# EAGLE design solderpeek (EAGLE 7.2.0)
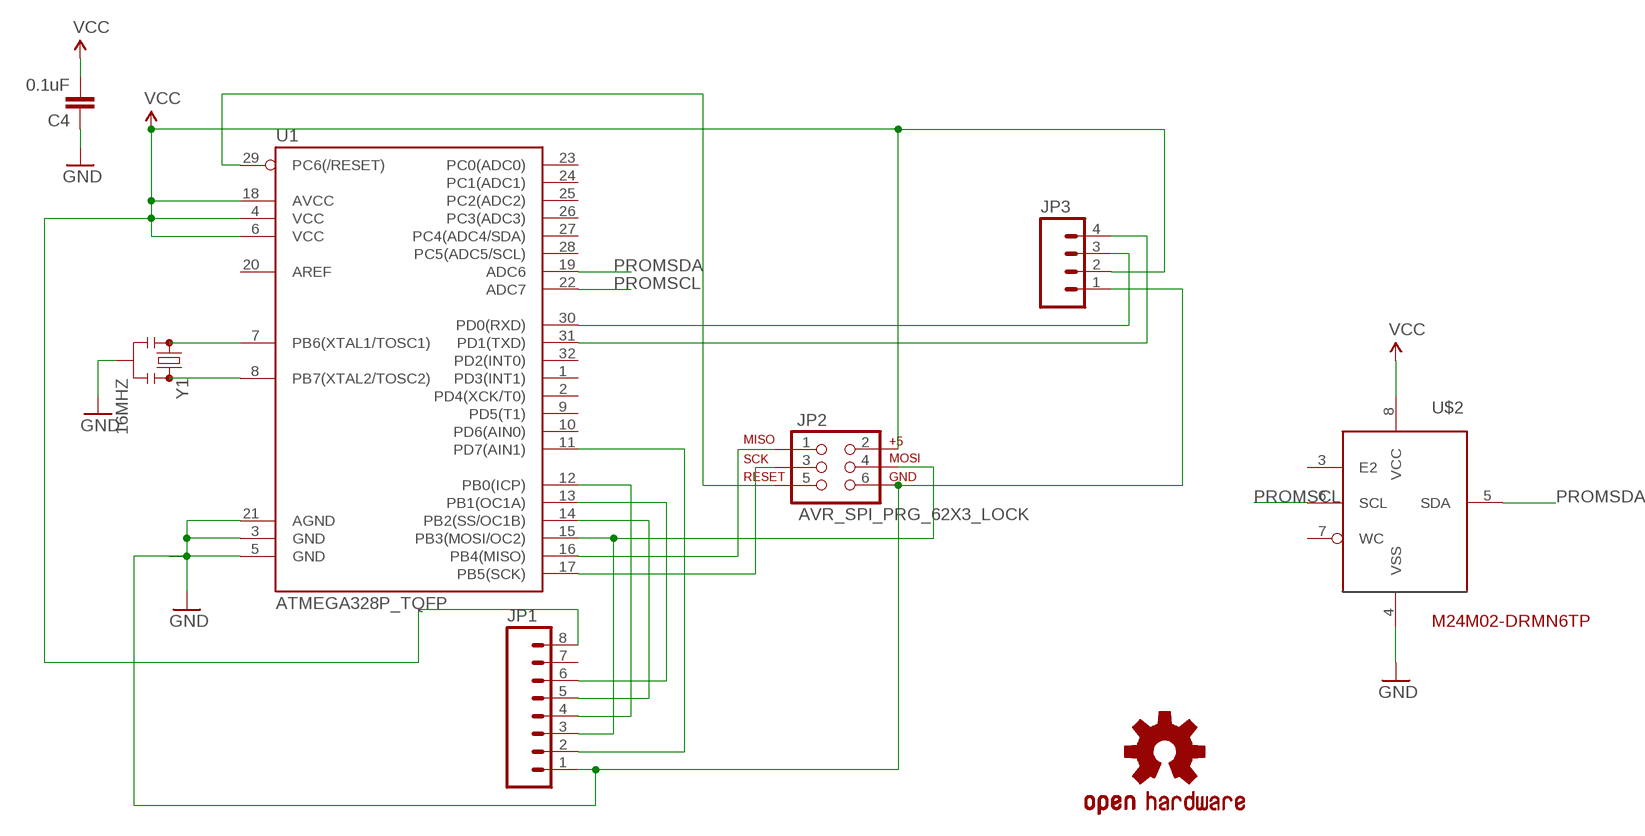
[diagram p0: schematic, sheet 1]

## Parts
C4  0.1uF  0.1UF-25V(+80/-20%)(0603)  [0603-CAP]
JP1  M08LOCK  [1X08_LOCK]
JP2  AVR_SPI_PRG_62X3_LOCK  [2X3_LOCK]
JP3  M04LOCK  [1X04_LOCK]
LOGO1  OSHW-LOGOS  [OSHW-LOGO-S]
U1  ATMEGA328P_TQFP  [TQFP32-08]
U$2  M24M02-DRMN6TP  [SO8]
Y1  16MHZ  RESONATOR16MHZ  [RESONATOR-SMD]

## Nets
GND [power]: C4.1 JP1.1 JP2.6 JP3.1 U1.3(GND) U1.5(GND) U1.21(AGND) U$2.4(VSS) Y1.2
N$1: U1.7(PB6(XTAL1/TOSC1)) Y1.1
N$2: U1.8(PB7(XTAL2/TOSC2)) Y1.3
N$3: JP2.1 U1.16(PB4(MISO))
N$4: JP1.3 JP2.4 U1.15(PB3(MOSI/OC2))
N$5: JP1.4 U1.12(PB0(ICP))
N$6: JP1.5 U1.14(PB2(SS/OC1B))
N$7: JP1.6 U1.13(PB1(OC1A))
N$8: JP1.2 U1.11(PD7(AIN1))
N$9: JP2.3 U1.17(PB5(SCK))
N$10: JP2.5 U1.29(PC6(/RESET))
N$11: JP3.3 U1.30(PD0(RXD))
N$12: JP3.4 U1.31(PD1(TXD))
PROMSCL: U1.22(ADC7) U$2.6(SCL)
PROMSDA: U1.19(ADC6) U$2.5(SDA)
VCC [power]: C4.2 JP1.8 JP2.2 JP3.2 U1.4(VCC) U1.6(VCC) U1.18(AVCC) U$2.8(VCC)
Unconnected: JP1.7 U1.1(PD3(INT1)) U1.2(PD4(XCK/T0)) U1.9(PD5(T1)) U1.10(PD6(AIN0)) U1.20(AREF) U1.23(PC0(ADC0)) U1.24(PC1(ADC1)) U1.25(PC2(ADC2)) U1.26(PC3(ADC3)) U1.27(PC4(ADC4/SDA)) U1.28(PC5(ADC5/SCL)) U1.32(PD2(INT0)) U$2.3(E2) U$2.7(WC)

## Library data of the parts
C4 = SparkFun-Capacitors:0.1UF-25V(+80/-20%)(0603): CAP-00810 Ceramic Standard decoupling cap; PROD_ID: CAP-00810
JP1 = SparkFun-Connectors:M08: Header 8 Standard 8-pin 0.1" header. Use with straight break away headers (SKU : PRT-00116), right angle break away headers (PRT-00553), swiss pins (PRT-00743), machine pins (PRT-00117), and female headers (PRT-00115).
JP2 = SparkFun-Connectors:AVR_SPI_PRG_6: AVR ISP 6 Pin This is the reduced ISP connector for AVR programming. Common on Arduino. This footprint will take up less PCB space and can be used with a 10-pin to 6-pin adapter such as SKU: BOB-08508 **Special note about "TEST_POINT" package. The stop mask is on the top side, so if you want your programming test points to be on the bottom of your board, make sure to place this package on the bottom side of the board. This also ensure that the orientation to program from the bottom side will be correct.
JP3 = SparkFun-Connectors:M04: Header 4 Standard 4-pin 0.1" header. Use with straight break away headers (SKU : PRT-00116), right angle break away headers (PRT-00553), swiss pins (PRT-00743), machine pins (PRT-00117), and female headers (PRT-00115). Molex polarized connector foot print use with SKU : PRT-08231 with associated crimp pins and housings. 1MM SMD Version SKU: PRT-10208
LOGO1 = SparkFun-Aesthetics:OSHW-LOGO: Open Source Hardware Logo This logo indicates the piece of hardware it is found on incorporates a OSHW license and/or adheres to the definition of open source hardware found here: http://freedomdefined.org/OSHW
U1 = SparkFun-DigitalIC:ATMEGA328P_TQFP; PROD_ID: IC-09069
U$2 = untitled:M24M02-DRMN6TP: EEPROM 2 Mbit serial I2C 1.8V to 5.5V EEPROM
Y1 = SparkFun-FreqCtrl:RESONATOR: Resonator Small SMD resonator. Used, eg, on the Arduino Pro/ Pro Mini boards. 8MHz- XTAL-08895 16MHz- XTAL-08900; PROD_ID: XTAL-08900

## Net classes
1 power: width 0.254 mm

## Board
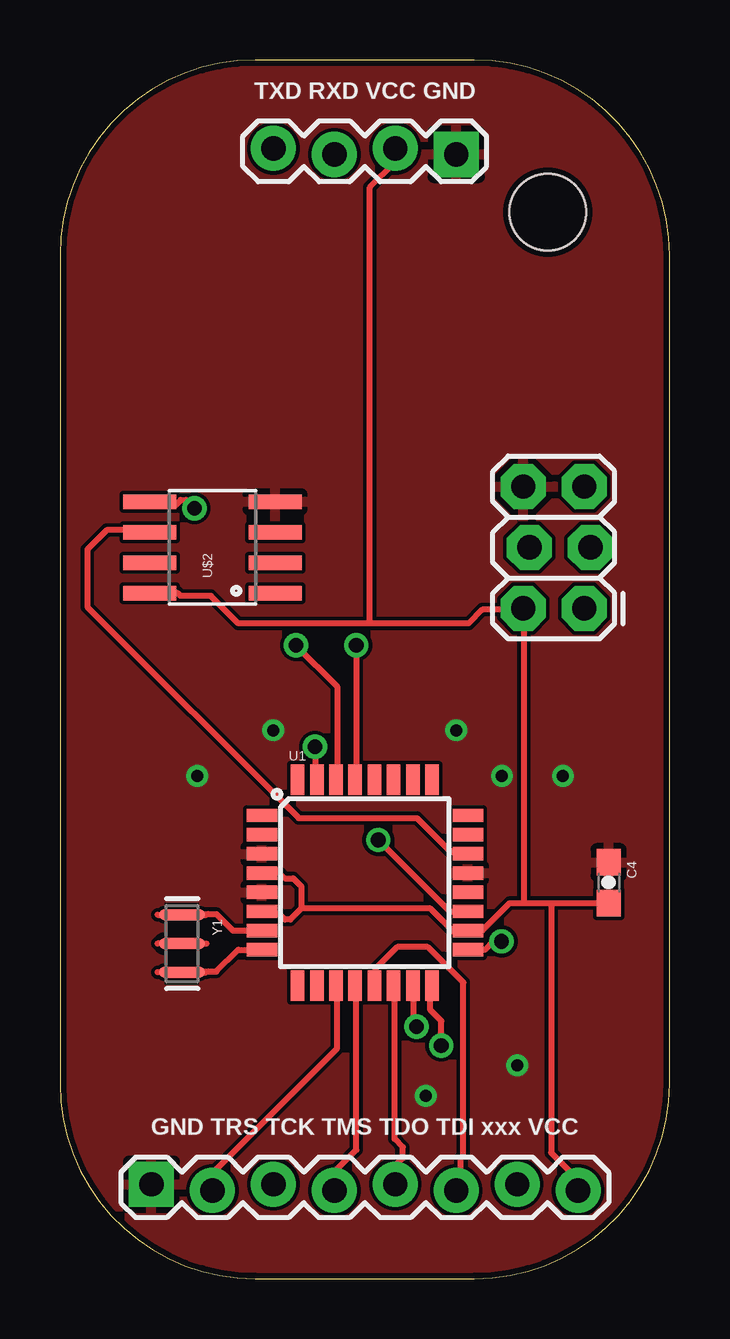
[diagram p1: board, top side]
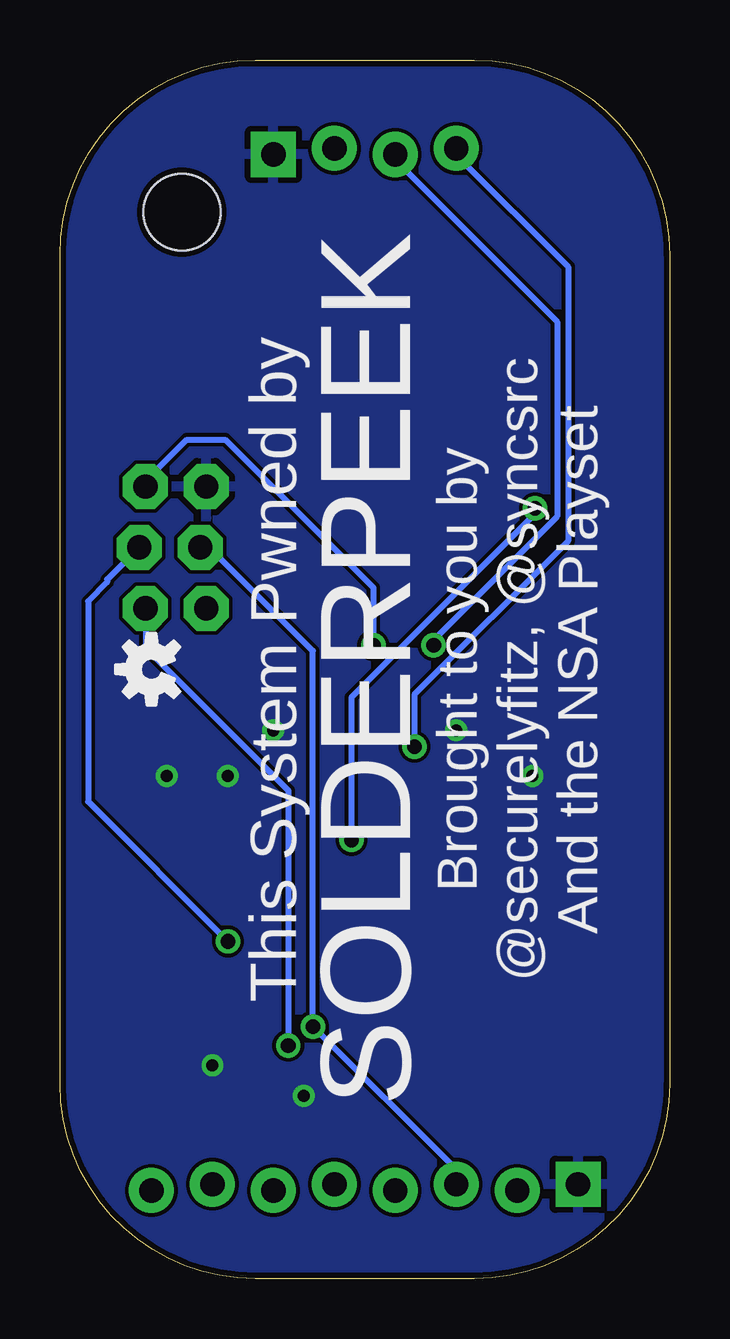
[diagram p2: board, bottom side, seen from below]

Size 25.4 x 50.8 mm. Coordinates in mm from the lower left corner, seen from the top.
Outline: 17.27,50.8 8.13,50.8 arc90 0,42.67 0,8.13 arc90 8.13,0 17.27,0 arc90 25.4,8.13 25.4,42.67 arc90 17.27,50.8
Copper layers (1*16): Top 0.035mm / dielectric 1.5mm / Bottom 0.035mm
Design rules "DFRobot_Eagle_Rule_v0.4": minimum track width 6mil, minimum drill 12mil, track to track 6mil, track to pad 6mil, pad to pad 6mil, via to via 6mil, smd to smd 0mil, copper to edge 10mil, drill to drill 10mil, minimum pad ring 12mil, minimum via ring 8mil, stop-mask expansion 2mil, vias tented up to drill 25mil, thermal gap 10mil
Holes 3.2 mm at 20.32,44.45

### Footprints (pad centres in the part's own frame; a part is rotated, then mirrored left to right if it is on the bottom)
0603-CAP = smd 1.1 x 1: 1 -0.85,0; 2 0.85,0
1X08_LOCK = drill 1.016 pad 1.88 square: 1 0,0.127 | drill 1.016 pad 1.88: 2 2.54,-0.127; 3 5.08,0.127; 4 7.62,-0.127; 5 10.16,0.127; 6 12.7,-0.127; 7 15.24,0.127; 8 17.78,-0.127
2X3_LOCK = drill 1.016 pad 1.88 octagon: 1 0,0; 2 0,2.54; 3 2.54,-0.254; 4 2.54,2.286; 5 5.08,0; 6 5.08,2.54
1X04_LOCK = drill 1.016 pad 1.88 square: 1 0,0.127 | drill 1.016 pad 1.88: 2 2.54,-0.127; 3 5.08,0.127; 4 7.62,-0.127
TQFP32-08 = smd 1.27 x 0.559: 1 -4.293,2.8; 2 -4.293,2; 3 -4.293,1.2; 4 -4.293,0.4; 5 -4.293,-0.4; 6 -4.293,-1.2; 7 -4.293,-2; 8 -4.293,-2.8; 17 4.293,-2.8; 18 4.293,-2; 19 4.293,-1.2; 20 4.293,-0.4; 21 4.293,0.4; 22 4.293,1.2; 23 4.293,2; 24 4.293,2.8 | smd 0.559 x 1.27: 9 -2.8,-4.293; 10 -2,-4.293; 11 -1.2,-4.293; 12 -0.4,-4.293; 13 0.4,-4.293; 14 1.2,-4.293; 15 2,-4.293; 16 2.8,-4.293; 25 2.8,4.293; 26 2,4.293; 27 1.2,4.293; 28 0.4,4.293; 29 -0.4,4.293; 30 -1.2,4.293; 31 -2,4.293; 32 -2.8,4.293
SO8 = smd 0.61 x 2.21: 1 -1.905,-2.616; 2 -0.635,-2.616; 3 0.635,-2.616; 4 1.905,-2.616; 5 1.905,2.616; 6 0.635,2.616; 7 -0.635,2.616; 8 -1.905,2.616
RESONATOR-SMD = smd 0.45 x 1.905: 1 -1.2,0; 2 0,0; 3 1.2,0

### Placement (x,y rotation side)
C4  22.86,16.51 270 top
JP1  3.81,3.81 0 top
JP2  21.84,27.94 90 top
JP3  16.51,46.99 180 top
LOGO1  21.59,25.4 90 bottom
U1  12.7,16.51 0 top
U$2  6.35,30.48 90 top
Y1  5.08,13.97 270 top

### Tracks (layer width: path | path; a pad name or v marks a point on that pad's centre or on a via)
GND  (via drill 0.5)
  other vias: 19.05,8.89 15.24,7.62 8.89,22.86 16.51,22.86 18.41,20.95 20.95,20.95 5.71,20.95
  pour Bottom: 0,0 25.4,0 25.4,50.8 0,50.8
  pour Top: 0,0 25.4,0 25.4,50.8 0,50.8
N$1
  Top 0.254: U1.7 8.34,14.52 7.2,14.52 6.51,15.2 6.17,15.2 Y1.1
N$2
  Top 0.254: U1.8 8.34,13.72 7.43,13.72 6.51,12.8 6.17,12.8 Y1.3
N$3  (via drill 0.61)
  Top 0.254: v15.89,9.72 15.89,10.74 15.43,11.2 15.43,12.12 U1.16
  Bottom 0.254: v15.89,9.72 15.89,20.34 21.83,26.29 21.83,27.89 JP2.1
N$4  (via drill 0.61)
  Top 0.254: v14.86,10.52 14.74,10.63 14.74,12.12 U1.15
  Bottom 0.254: JP1.3 8.91,4 8.91,4.57 v14.86,10.52 14.86,26.18 19.09,30.4 19.55,30.4 JP2.4
N$5
  Top 0.254: JP1.4 11.43,4.46 12.34,5.37 12.34,12.12 U1.12
N$6
  Top 0.254: U1.14 13.95,12.12 13.95,5.83 14.29,5.49 14.29,5.03 14.06,4.8 14.06,4 JP1.5
N$7
  Top 0.254: U1.13 13.14,12.23 13.14,12.92 14.06,13.83 15.32,13.83 16.8,12.34 16.8,5.14 16.69,5.03 16.69,3.89 16.57,3.77 JP1.6
N$8
  Top 0.254: U1.11 11.54,12.12 11.54,9.6 6.4,4.46 6.4,3.77 JP1.2
N$9  (via drill 0.61)
  Top 0.254: v18.4,14.06 18.06,14.06 17.72,13.72 17.03,13.72 U1.17
  Bottom 0.254: v18.4,14.06 24.23,19.89 24.23,28.23 23.43,29.03 23.43,29.15 JP2.3
N$10  (via drill 0.61)
  Top 0.254: v12.34,26.4 12.34,20.8 U1.29
  Bottom 0.254: v12.34,26.4 12.34,28.8 18.52,34.98 20.12,34.98 21.83,33.26 21.83,33.03 JP2.5
N$11  (via drill 0.61)
  Top 0.254: v9.83,26.4 11.54,24.69 11.54,20.8 U1.30
  Bottom 0.254: v9.83,26.4 9.83,26.63 4.69,31.77 4.69,39.89 11.43,46.63 JP3.3
N$12  (via drill 0.61)
  Top 0.254: v10.63,22.17 10.63,20.8 U1.31
  Bottom 0.254: v10.63,22.17 10.63,24.35 4.23,30.75 4.23,42.18 8.8,46.75 8.8,47.09 JP3.4
PROMSCL
  Top 0.254: U1.22 16.92,17.72 16.46,17.72 16.34,17.83 16.23,17.83 14.86,19.2 9.94,19.2 1.14,28 1.14,30.4 1.94,31.2 3.66,31.2 U$2.6
PROMSDA  (via drill 0.61)
  Top 0.254: v13.26,18.29 16.23,15.32 16.92,15.32 U1.19 | v5.6,32.12 5.26,32.46 5.03,32.46 4.8,32.23 3.89,32.23 U$2.5
  Bottom 0.254: v13.26,18.29 13.26,24.23 5.6,31.89 v5.6,32.12
VCC
  Top 0.254: 10.06,15.43 9.6,14.97 9.37,14.97 9.14,15.2 8.46,15.2 U1.6 | 10.06,15.43 10.06,16.34 9.72,16.69 9.37,16.69 9.03,17.03 8.57,17.03 8.46,16.92 U1.4 | 19.32,15.66 18.75,15.66 17.6,14.52 17.03,14.52 U1.18 16.92,14.4 16.46,14.4 15.43,15.43 10.06,15.43 | 19.32,15.66 20.46,15.66 | 20.46,15.66 C4.2 | 20.46,15.66 20.46,5.26 21.49,4.23 21.49,3.77 JP1.8 | U$2.8 4.92,28.57 5.03,28.46 6.29,28.46 7.43,27.32 12.92,27.32 | 12.92,27.32 17.03,27.32 17.6,27.89 19.2,27.89 JP2.2 19.32,27.89 19.32,15.66 | 12.92,27.32 12.92,45.49 13.95,46.52 13.95,47.09 JP3.2

### Text on the board
tPlace: TXD RXD VCC GND | GND TRS TCK TMS TDO TDI xxx VCC
bPlace: Brought to you by / @securelyfitz, @syncsrc / And the NSA Playset | SOLDERPEEK | This System Pwned by